# EAGLE design dcdr_3.1 (EAGLE 7.7.0)
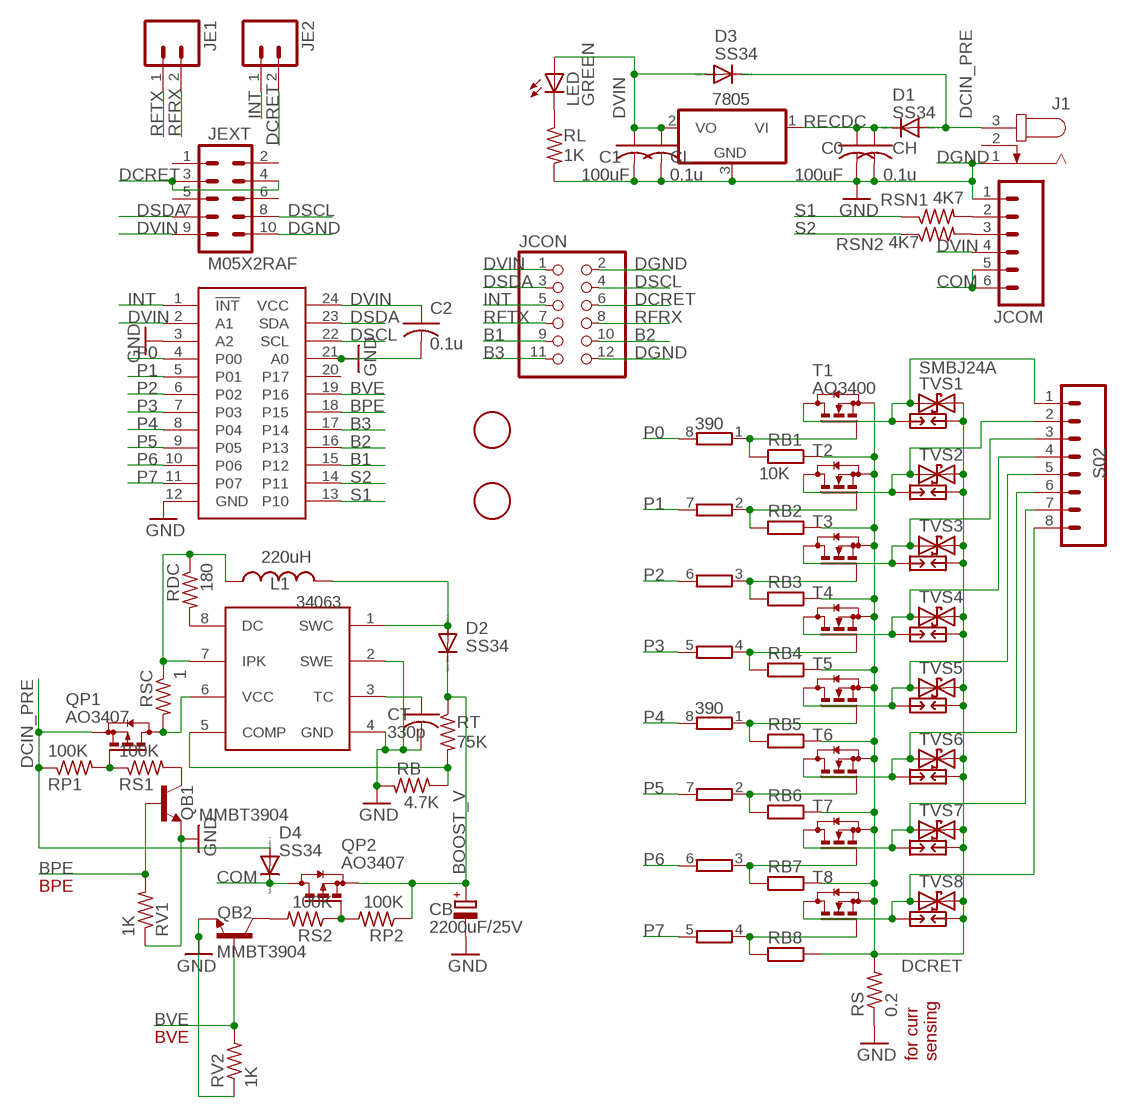
[diagram p0: schematic, sheet 1]

## Parts
7805  7805DT  [TO252]
34063  MC34063  MC33063/MC34063D  [SO08]
C0  100uF  C-USC0805K  [C0805K]
C1  100uF  C-USC0805K  [C0805K]
C2  0.1u  C-USC0603  [C0603]
CB  2200uF/25V  CPOL-EUE7.5-16  [E7,5-16]
CH  0.1u  C-USC0603  [C0603]
CL  0.1u  C-USC0603  [C0603]
CT  330p  C-USC0603K  [C0603K]
D1  SS34  DIODE-SMB  [SMB]
D2  SS34  DIODE-SMB  [SMB]
D3  SS34  DIODE-SMB  [SMB]
D4  SS34  DIODE-SMB  [SMB]
J1  JACK-PLUG0  [SPC4077]
JCOM  M065MM  [SCREWTERMINAL-5MM-6]
JCON  PINHD-2X6  [2X06]
JE1  M02PTH  [1X02]
JE2  M02PTH  [1X02]
JEXT  M05X2RAF  [2X5-RAF]
L1  220uH  INDUCTORCR54  [CR54]
LED  GREEN  LEDCHIPLED_0805  [CHIPLED_0805]
PCA9555  PCA9555  PCF8575TSSOP24  [TSSOP24]
QB1  MMBT3904  TRANSISTOR_NPNSOT23-3  [SOT23-3]
QB2  MMBT3904  TRANSISTOR_NPNSOT23-3  [SOT23-3]
QP1  AO3407  BSS84  [SOT23]
QP2  AO3407  BSS84  [SOT23]
RB  4.7K  R-US_R0603  [R0603]
RB1  10K  R-EU_R0603  [R0603]
RB2  10K  R-EU_R0603  [R0603]
RB3  10K  R-EU_R0603  [R0603]
RB4  10K  R-EU_R0603  [R0603]
RB5  10K  R-EU_R0603  [R0603]
RB6  10K  R-EU_R0603  [R0603]
RB7  10K  R-EU_R0603  [R0603]
RB8  10K  R-EU_R0603  [R0603]
RDC  180  R-US_R0603  [R0603]
RL  1K  R-US_R0603  [R0603]
RN1  390  4R-NEXB38V  [EXB38V]
RN2  390  4R-NEXB38V  [EXB38V]
RP1  100K  R-US_R0603  [R0603]
RP2  100K  R-US_R0603  [R0603]
RS  0.2  R-US_R2512  [R2512]
RS1  100K  R-US_R0603  [R0603]
RS2  100K  R-US_R0603  [R0603]
RSC  1  R-US_R0603  [R0603]
RSN1  4K7  R-US_R0603  [R0603]
RSN2  4K7  R-US_R0603  [R0603]
RT  75K  R-US_R0603  [R0603]
RV1  1K  R-US_R0603  [R0603]
RV2  1K  R-US_R0603  [R0603]
S02  M085MM-8  [SCREWTERMINAL-5MM-8]
SP1  PCB-SGAP  [PCB-SGAP]
SP2  PCB-SGAP  [PCB-SGAP]
SP3  PCB-SGAP  [PCB-SGAP]
SP4  PCB-SGAP  [PCB-SGAP]
SP5  PCB-SGAP  [PCB-SGAP]
SP6  PCB-SGAP  [PCB-SGAP]
SP7  PCB-SGAP  [PCB-SGAP]
SP8  PCB-SGAP  [PCB-SGAP]
T1  AO3400  BSS123  [SOT23]
T2  AO3400  BSS123  [SOT23]
T3  AO3400  BSS123  [SOT23]
T4  AO3400  BSS123  [SOT23]
T5  AO3400  BSS123  [SOT23]
T6  AO3400  BSS123  [SOT23]
T7  AO3400  BSS123  [SOT23]
T8  AO3400  BSS123  [SOT23]
TVS1  SMBJ24A  TVSSMB  [SMB]
TVS2  SMBJ24A  TVSSMB  [SMB]
TVS3  SMBJ24A  TVSSMB  [SMB]
TVS4  SMBJ24A  TVSSMB  [SMB]
TVS5  SMBJ24A  TVSSMB  [SMB]
TVS6  SMBJ24A  TVSSMB  [SMB]
TVS7  SMBJ24A  TVSSMB  [SMB]
TVS8  SMBJ24A  TVSSMB  [SMB]
U$1  FIDUCIAL  [FIDUCIAL_1MM]
U$2  FIDUCIAL  [FIDUCIAL_1MM]

## Nets
B1: JCON.9 PCA9555.15(P12)
B2: JCON.10 PCA9555.16(P13)
B3: JCON.11 PCA9555.17(P14)
BOOST_V: CB.+ D2.C QP2.2(S) RP2.1 RT.1
BPE: PCA9555.18(P15) QB1.1(B) RV1.2
BVE: PCA9555.19(P16) QB2.1(B) RV2.2
COM [power]: D4.C JCOM.5 JCOM.6 QP2.3(D)
DCIN_PRE: D1.A D3.C D4.A J1.3 QP1.2(S) RP1.1
DCRET: JCON.6 JE2.2 JEXT.3 JEXT.4 RB1.1 RB2.1 RB3.1 RB4.1 RB5.1 RB6.1 RB7.1 RB8.1 RS.2 SP1.1 SP2.1 SP3.1 SP4.1 SP5.1 SP6.1 SP7.1 SP8.1 T1.2(S) T2.2(S) T3.2(S) T4.2(S) T5.2(S) T6.2(S) T7.2(S) T8.2(S) TVS1.C TVS2.C TVS3.C TVS4.C TVS5.C TVS6.C TVS7.C TVS8.C
DGND [power]: 7805.3(GND) 34063.2(SWE) 34063.4(GND) C0.2 C1.2 C2.2 CB.- CH.2 CL.2 CT.2 J1.1 JCOM.1 JCON.2 JCON.12 JEXT.10 PCA9555.3(A2) PCA9555.12(GND) PCA9555.21(A0) QB1.2(E) QB2.2(E) RB.2 RL.2 RS.1 RV1.1 RV2.1 ; supply symbol labelled GND
DSCL: JCON.4 JEXT.8 PCA9555.22(SCL)
DSDA: JCON.3 JEXT.7 PCA9555.23(SDA)
DVIN [power]: 7805.2(VO) C1.1 C2.1 CL.1 D3.A JCOM.4 JCON.1 JEXT.9 LED.A PCA9555.2(A1) PCA9555.24(VCC)
INT: JCON.5 JE2.1 PCA9555.1(!INT)
N$1: 34063.1(SWC) D2.A L1.P$2
N$2: JCOM.2 RSN1.2
N$3: JCOM.3 RSN2.2
N$8: RB1.2 RN1.1 T1.1(G)
N$9: RB2.2 RN1.2 T2.1(G)
N$15: RB3.2 RN1.3 T3.1(G)
N$16: RB4.2 RN1.4 T4.1(G)
N$17: 34063.3(TC) CT.1
N$18: RB5.2 RN2.1 T5.1(G)
N$19: RB6.2 RN2.2 T6.1(G)
N$21: RB7.2 RN2.3 T7.1(G)
N$22: RB8.2 RN2.4 T8.1(G)
N$24: 34063.8(DC) RDC.2
N$26: 34063.7(IPK) L1.P$1 RDC.1 RSC.1
N$27: 34063.6(VCC) QP1.3(D) RSC.2
N$28: LED.C RL.1
N$29: 34063.5(COMP) RB.1 RT.2
N$30: QP1.1(G) RP1.2 RS1.1
N$34: QB2.3(C) RS2.2
N$35: QB1.3(C) RS1.2
N$38: QP2.1(G) RP2.2 RS2.1
N$50 [power]: S02.1 SP1.2 T1.3(D) TVS1.A
N$51 [power]: S02.2 SP2.2 T2.3(D) TVS2.A
N$52 [power]: S02.3 SP3.2 T3.3(D) TVS3.A
N$53 [power]: S02.4 SP4.2 T4.3(D) TVS4.A
N$54 [power]: S02.5 SP5.2 T5.3(D) TVS5.A
N$55 [power]: S02.6 SP6.2 T6.3(D) TVS6.A
N$56 [power]: S02.7 SP7.2 T7.3(D) TVS7.A
N$57 [power]: S02.8 SP8.2 T8.3(D) TVS8.A
P0: PCA9555.4(P00) RN1.8
P1: PCA9555.5(P01) RN1.7
P2: PCA9555.6(P02) RN1.6
P3: PCA9555.7(P03) RN1.5
P4: PCA9555.8(P04) RN2.8
P5: PCA9555.9(P05) RN2.7
P6: PCA9555.10(P06) RN2.6
P7: PCA9555.11(P07) RN2.5
RECDC: 7805.1(VI) C0.1 CH.1 D1.C
RFRX: JCON.8 JE1.2
RFTX: JCON.7 JE1.1
S1: PCA9555.13(P10) RSN1.1
S2: PCA9555.14(P11) RSN2.1
Unconnected: J1.2 JEXT.1 JEXT.2 JEXT.5 JEXT.6 PCA9555.20(P17)

## Notes on the sheet
- BPE
- BVE
- for curr
  sensing

## Library data of the parts
7805 = linear:78*: Positive VOLTAGE REGULATOR Source: http://cache.national.com/ds/LM/LM78L05.pdf http://www.fairchildsemi.com/ds/LM/LM7805.pdf
34063 = adafruit:MC33063/MC34063: MC33063 and MC34063 Basic DC/DC converter with internal power-NPN transistor, 100KHz, 1.5A peak switch current. 3-40 input/output.
C0 C1 C2 CH CL CT = adafruit:C-US: CAPACITOR, American symbol
CB = rcl:CPOL-EU: POLARIZED CAPACITOR, European symbol
D1-D4 = diode:DIODE-: DIODE
J1 = con-jack:JACK-PLUG: DC POWER JACK Power Jack, DC, Right Angle, Through Hole, Rated 5A at 16VDC, PC Terminals Distributor: Farnell (www.Farnell.de) Drawing: 84N1161.pdf / 84N1162.pdf Manufacturer: SPC Technology (www.spctechnology.com) Type: SPC4077 / SPC 4078; OC_FARNELL: unknown; OC_NEWARK: unknown
JCOM = SparkFun:M06: Header 6 Standard 6-pin 0.1" header. Use with straight break away headers (SKU : PRT-00116), right angle break away headers (PRT-00553), swiss pins (PRT-00743), machine pins (PRT-00117), and female headers (PRT-00115). Molex polarized connector foot print use with SKU : PRT-08094 with associated crimp pins and housings. NOTES ON THE VARIANTS LOCK and LOCK_LONGPADS... This footprint was designed to help hold the alignment of a through-hole component (i.e. 6-pin header) while soldering it into place. You may notice that each hole has been shifted either up or down by 0.005 of an inch from it's more standard position (which is a perfectly straight line). This slight alteration caused the pins (the squares in the middle) to touch the edges of the holes. Because they are alternating, it causes a "brace" to hold the component in place. 0.005 has proven to be the perfect amount of "off-center" position when using our standard breakaway headers. Although looks a little odd when you look at the bare footprint, once you have a header in there, the alteration is very hard to notice. Also, if you push a header all the way into place, it is covered up entirely on the bottom side. This idea of altering the position of holes to aid alignment will be further integrated into the Sparkfun Library for other footprints. It can help hold any component with 3 or more connection pins.
JCON = pinhead:PINHD-2X6: PIN HEADER
JE1 JE2 = SparkFunNew:M02: Header 2 Standard 2-pin 0.1" header. Use with straight break away headers (SKU : PRT-00116), right angle break away headers (PRT-00553), swiss pins (PRT-00743), machine pins (PRT-00117), and female headers (PRT-00115). Molex polarized connector foot print use with SKU : PRT-08233 with associated crimp pins and housings.
JEXT = SparkFunNew:M05X2: Header 5x2 Standard 10-pin dual row 0.1" header. Commonly used with AVR-ISP. Use with Spark Fun Electronics SKU: PRT-00778
L1 = SparkFunNew:INDUCTOR: Inductors Basic Inductor/Choke - 0603 and 1206. Footprints are not proven and vary greatly between part numbers.
LED = adafruit:LED: LED OSRAM: - CHIPLED LG R971, LG N971, LY N971, LG Q971, LY Q971, LO R971, LY R971 LH N974, LH R974 LS Q976, LO Q976, LY Q976 LO Q996 - Hyper CHIPLED LW Q18S LB Q993, LB Q99A, LB R99A - SideLED LS A670, LO A670, LY A670, LG A670, LP A670 LB A673, LV A673, LT A673, LW A673 LH A674 LY A675 LS A676, LA A676, LO A676, LY A676, LW A676 LS A679, LY A679, LG A679 - Hyper Micro SIDELED® LS Y876, LA Y876, LO Y876, LY Y876 LT Y87S - SmartLED LW L88C, LW L88S LB L89C, LB L89S, LG L890 LS L89K, LO L89K, LY L89K LS L896, LA L896, LO L896, LY L896 - TOPLED LS T670, LO T670, LY T670, LG T670, LP T670 LSG T670, LSP T670, LSY T670, LOP T670, LYG T670 LG T671, LOG T671, LSG T671 LB T673, LV T673, LT T673, LW T673 LH T674 LS T676, LA T676, LO T676, LY T676, LB T676, LH T676, LSB T676, LW T676 LB T67C, LV T67C, LT T67C, LS T67K, LO T67K, LY T67K, LW E67C LS E67B, LA E67B, LO E67B, LY E67B, LB E67C, LV E67C, LT E67C LW T67C LS T679, LY T679, LG T679 LS T770, LO T770, LY T770, LG T770, LP T770 LB T773, LV T773, LT T773, LW T773 LH T774 LS E675, LA E675, LY E675, LS T675 LS T776, LA T776, LO T776, LY T776, LB T776 LHGB T686 LT T68C, LB T68C - Hyper Mini TOPLED® LB M676 - Mini TOPLED Santana® LG M470 LS M47K, LO M47K, LY M47K Source: http://www.osram.convergy.de/
PCA9555 = SparkFunNew:PCF8575
QB1 QB2 = SparkFunNew:TRANSISTOR_NPN: Transistor NPN BJT configuration in SOT23 package. MMBT2222 is the common NPN we use. Double check BCE configuration again layout.
QP1 QP2 = transistor-small-signal:BSS84: P-CHANNEL MOS FET
RB RDC RP1 RP2 RS1 RS2 RSC RT RV1 RV2 = adafruitGood:R-US_: RESISTOR, American symbol
RB1-RB8 = rcl:R-EU_: RESISTOR, European symbol
RL RSN1 RSN2 = adafruit2013:R-US_: RESISTOR, American symbol
RN1 RN2 = resistor-dil:4R-N: Array Chip Resistor Source: RS Component / Phycomp; OC_FARNELL: unknown; OC_NEWARK: unknown
RS = adafruit:R-US_: RESISTOR, American symbol
S02 = SparkFun:M08: Header 8 Standard 8-pin 0.1" header. Use with straight break away headers (SKU : PRT-00116), right angle break away headers (PRT-00553), swiss pins (PRT-00743), machine pins (PRT-00117), and female headers (PRT-00115).
SP1-SP8 = varistor:PCB-SGAP
T1-T8 = transistor-small-signal:BSS123: N-CHANNEL MOS FET
TVS1-TVS8 = SparkFunNew:TVS
U$1 U$2 = adafruitGood:FIDUCIAL: For use by pick and place machines to calibrate the vision/machine, 1mm By microbuilder.eu

## Net classes
0 default: width 0.178 mm, clearance 0.178 mm
1 power: width 0.178 mm, clearance 0.178 mm
2 relaypower: width 0.178 mm, clearance 0.178 mm
3 signal: width 0.178 mm, clearance 0.178 mm
4 adc: width 0.406 mm, clearance 0.178 mm

## Board
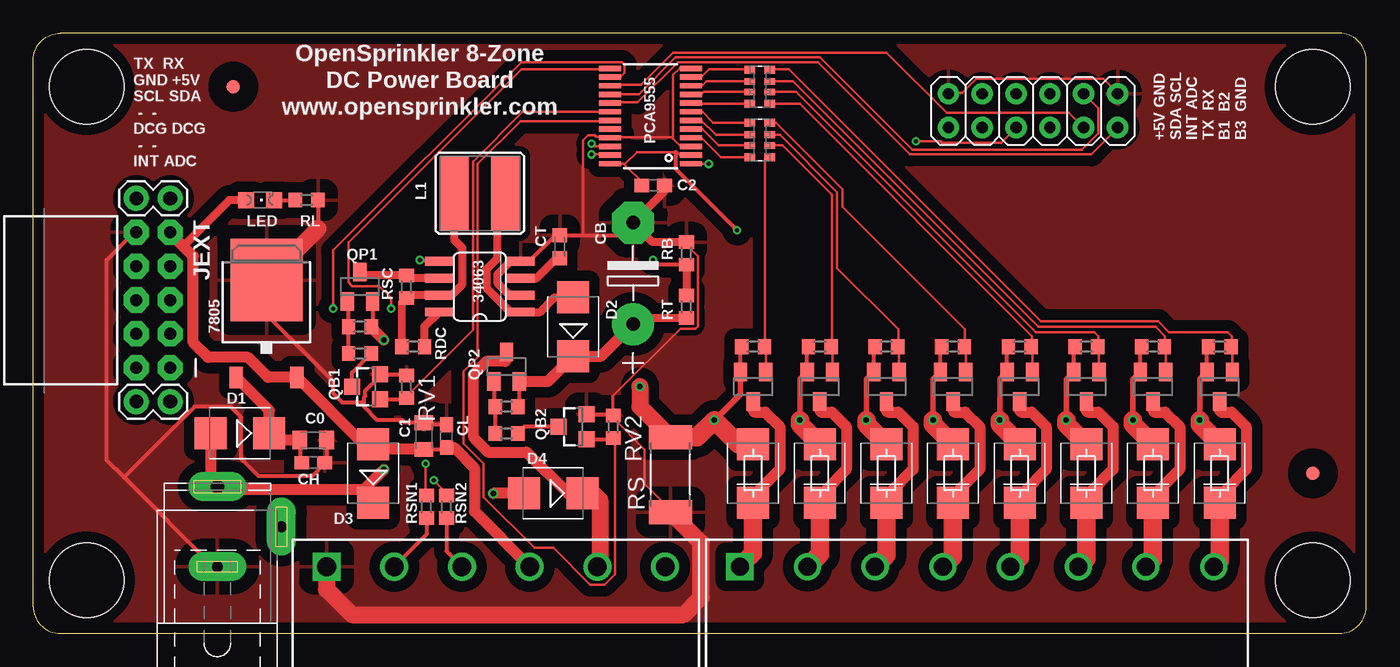
[diagram p1: board, top side]
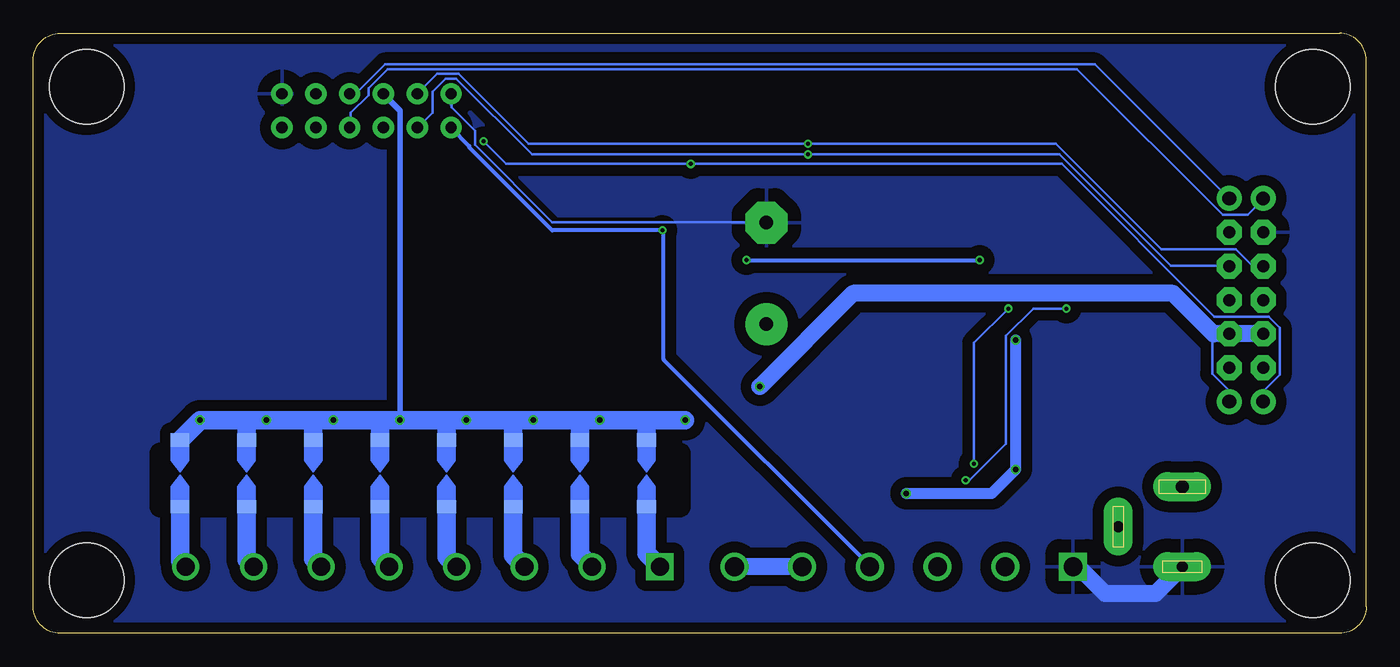
[diagram p2: board, bottom side, seen from below]

Size 100 x 45 mm. Coordinates in mm from the lower left corner, seen from the top.
Outline: 2,0 98,0 arc90 100,2 100,43 arc90 98,45 2,45 arc90 0,43 0,2 arc90 2,0
Copper layers (1*16): Top 0.035mm / dielectric 1.5mm / Bottom 0.035mm
Design rules "Fusion_eagle_rule_v1.1 *": minimum track width 6mil, minimum drill 12mil, track to track 6mil, track to pad 6mil, pad to pad 6mil, via to via 6mil, smd to smd 0mil, copper to edge 10mil, drill to drill 10mil, minimum pad ring 10mil, minimum via ring 6mil, stop-mask expansion 2mil, vias tented up to drill 100mil, thermal gap 40mil
Holes 5.6 mm at 4,4 96,4 4,41 96,41
bRestrict: area 51.5,9.5 to 90.5,13.5

### Footprints (pad centres in the part's own frame; a part is rotated, then mirrored left to right if it is on the bottom)
TO252 = smd 1 x 1.6: 1 -2.28,-4.8; 2 2.28,-4.8 | smd 5.4 x 6.2: 3 0,2.5
SO08 = smd 0.66 x 2.032: 1 -1.905,-3.073; 2 -0.635,-3.073; 3 0.635,-3.073; 4 1.905,-3.073; 5 1.905,3.073; 6 0.635,3.073; 7 -0.635,3.073; 8 -1.905,3.073
C0805K = smd 1.1 x 1.4: 1 -1,0; 2 1,0
C0603 = smd 1.1 x 1: 1 -0.85,0; 2 0.85,0
E7,5-16 = drill 1.016 pad 3.15: + -3.81,0 | drill 1.016 pad 3.15 octagon: - 3.81,0
C0603K = smd 1.05 x 1.08: 1 -0.875,0; 2 0.875,0
SMB = smd 2.4 x 2.4: A 2.2,0; C -2.2,0
SPC4077 = drill 0.8 pad 2.184 long: 1 -3,0; 2 0,-4.8 | drill 1 pad 2.184 long: 3 3,0
SCREWTERMINAL-5MM-6 = drill 1.4 pad 2.032 square: 1 0,0 | drill 1.4 pad 2.032: 2 5.08,0; 3 10.16,0; 4 15.24,0; 5 20.32,0; 6 25.4,0
2X06 = drill 0.85 pad 1.6: 1 -6.35,-1.27; 2 -6.35,1.27; 3 -3.81,-1.27; 4 -3.81,1.27; 5 -1.27,-1.27; 6 -1.27,1.27; 7 1.27,-1.27; 8 1.27,1.27; 9 3.81,-1.27; 10 3.81,1.27; 11 6.35,-1.27; 12 6.35,1.27
1X02 = drill 1.016 pad 1.88: 1 0,0; 2 2.54,0
2X5-RAF = drill 0.9 pad 1.88 octagon: 1 -1.27,5.08; 2 1.27,5.08; 3 -1.27,2.54; 4 1.27,2.54; 5 -1.27,0; 6 1.27,0; 7 -1.27,-2.54; 8 1.27,-2.54; 9 -1.27,-5.08; 10 1.27,-5.08
CR54 = smd 5.5 x 2.15: P$1 0,1.92; P$2 0,-1.92
CHIPLED_0805 = smd 1.2 x 1.2: A 0,-1.05; C 0,1.05
TSSOP24 = smd 0.4 x 1.65: 1 -3.575,-3.05; 2 -2.925,-3.05; 3 -2.275,-3.05; 4 -1.625,-3.05; 5 -0.975,-3.05; 6 -0.325,-3.05; 7 0.325,-3.05; 8 0.975,-3.05; 9 1.625,-3.05; 10 2.275,-3.05; 11 2.925,-3.05; 12 3.575,-3.05; 13 3.575,3.05; 14 2.925,3.05; 15 2.275,3.05; 16 1.625,3.05; 17 0.975,3.05; 18 0.325,3.05; 19 -0.325,3.05; 20 -0.975,3.05; 21 -1.625,3.05; 22 -2.275,3.05; 23 -2.925,3.05; 24 -3.575,3.05
SOT23-3 = smd 1.2 x 1.2: 1 -0.95,-1; 2 0.95,-1; 3 0,1.1
SOT23 = smd 1 x 1.4: 1 -0.95,-1.1; 2 0.95,-1.1; 3 0,1.1
R0603 = smd 1 x 1.1: 1 -0.85,0; 2 0.85,0
EXB38V = smd 0.6 x 0.8: 1 -1.275,-0.75; 4 1.275,-0.75; 5 1.275,0.75; 8 -1.275,0.75 | smd 0.5 x 0.8: 2 -0.4,-0.75; 3 0.4,-0.75; 6 0.4,0.75; 7 -0.4,0.75
R2512 = smd 1.8 x 3.2: 1 -2.8,0; 2 2.8,0
SCREWTERMINAL-5MM-8 = drill 1.35 pad 2.032 square: 1 0,0 | drill 1.35 pad 2.032: 2 5.08,0; 3 10.16,0; 4 15.24,0; 5 20.32,0; 6 25.4,0; 7 30.48,0; 8 35.56,0
PCB-SGAP = smd 1 x 1.4 bottom: 1 -2.5,0; 2 2.5,0
FIDUCIAL_1MM = smd 1 x 1: 1 0,0

### Placement (x,y rotation side)
7805  17.5,24 0 top
34063  33.5,26 90 top
C0  21,14.5 0 top
C1  29.3,14.8 90 top
C2  46.5,33.6 0 top
CB  45,27 90 top
CH  21,12.8 0 top
CL  31,14.8 90 top
CT  39.5,29 90 top
D1  15.5,15 180 top
D2  40.5,23 90 top
D3  25.5,12 90 top
D4  39,10.5 180 top
J1  13.8,8 90 top
JCOM  22,5 0 top
JCON  75,39.2 0 top
JE1  7.73,32.62 0 top
JE2  7.73,17.38 0 top
JEXT  9,25 180 top
L1  33.5,33 90 top
LED  17,32.5 270 top
PCA9555  46.3,38.8 90 top
QB1  25,18.5 90 top
QB2  40.5,15.5 90 top
QP1  24.5,26 0 top
QP2  35.5,20 0 top
RB  49,28.5 90 top
RB1  54,21.5 0 top
RB2  59,21.5 0 top
RB3  64,21.5 0 top
RB4  69,21.5 0 top
RB5  74,21.5 0 top
RB6  79,21.5 0 top
RB7  84,21.5 0 top
RB8  89,21.5 0 top
RDC  28.5,21.5 0 top
RL  20.5,32.5 0 top
RN1  54.5,37 90 top
RN2  54.5,41 90 top
RP1  24.5,23 180 top
RP2  35.5,17 180 top
RS  47.8,11.9 90 top
RS1  24.5,21 0 top
RS2  35.5,15 0 top
RSC  28,26 90 top
RSN1  29.5,9.5 270 top
RSN2  31,9.5 270 top
RT  49,24.5 90 top
RV1  28,18.5 270 top
RV2  43.5,15.5 270 top
S02  53,5 0 top
SP1  54,12 270 top
SP2  59,12 270 top
SP3  64,12 270 top
SP4  69,12 270 top
SP5  74,12 270 top
SP6  79,12 270 top
SP7  84,12 270 top
SP8  89,12 270 top
T1  54,18.5 180 top
T2  59,18.5 180 top
T3  64,18.5 180 top
T4  69,18.5 180 top
T5  74,18.5 180 top
T6  79,18.5 180 top
T7  84,18.5 180 top
T8  89,18.5 180 top
TVS1  54,12 270 top
TVS2  59,12 270 top
TVS3  64,12 270 top
TVS4  69,12 270 top
TVS5  74,12 270 top
TVS6  79,12 270 top
TVS7  84,12 270 top
TVS8  89,12 270 top
U$1  15,41 0 top
U$2  96,12 0 top

### Tracks (layer width: path | path; a pad name or v marks a point on that pad's centre or on a via)
B1
  Top 0.178: PCA9555.15 43.29,41.16 45.61,41.16 48.01,43.56 64.01,43.56 68.54,39.03 77.7,39.03 78.77,37.96 JCON.9
B2
  Top 0.178: PCA9555.16 43.29,40.45 45.43,40.45 48.18,43.2 59.03,43.2 65.96,36.27 78.68,36.27 79.92,37.52 79.92,39.38 78.85,40.45 JCON.10
B3
  Top 0.178: PCA9555.17 43.29,39.83 45.34,39.83 48.36,42.85 58.85,42.85 65.79,35.92 79.39,35.92 81.34,37.87 JCON.11
BOOST_V
  Top 0.305: QP2.2 36.45,17.1 RP2.1
  Top 0.61: RT.1 45.46,23.65 CB.+
  Top 0.813: CB.+ 42.61,20.8 D2.C 38.6,18.9 QP2.2
BPE
  Top 0.178: PCA9555.18 43.2,39.12 36.72,39.12 32.98,35.38 32.98,22.76 28,17.78 RV1.2
  Top 0.305: QB1.1 27.9,17.55 RV1.2
BVE
  Top 0.178: PCA9555.19 43.2,38.41 36.54,38.41 33.34,35.2 33.34,20.71 32.27,19.65 32.27,14.22 33.78,12.71 33.78,10.22 37.6,6.4 39.03,6.4 41.78,3.65 42.85,3.65 43.65,4.45 43.65,14.13 43.38,14.4 RV2.2
  Top 0.305: QB2.1 43.4,14.55 RV2.2
COM
  Top 0.813: QP2.3 35.5,20.5 35.4,20.4 34,20.4 33,19.4 33,14.8 33.2,14.5 34.1,13.6 37,13.6 40.1,10.5 D4.C
  Top 1.27: D4.C 42,10.5 42.5,10 42.5,5 JCOM.5
  Bottom 1.27: JCOM.5 JCOM.6
DCIN_PRE  (via drill 0.41)
  Top 0.305: QP1.2 25.45,23.1 RP1.1
  Top 0.813: v26.3,22 25.4,22.9 RP1.1 | v26.3,12.3 24.9,10.9 D3.C 24.5,10.8 14.4,10.8 J1.3 13.3,11.5 D1.A | D4.A v34.5,10.5
  Bottom 0.813: v26.3,22 v26.3,12.3 28.1,10.5 v34.5,10.5
DCRET  (via drill 0.41)
  Top 0.305: T1.2 53.05,21.4 RB1.1 | T2.2 58.05,21.4 RB2.1 | T3.2 63.05,21.4 RB3.1 | T4.2 68.05,21.4 RB4.1 | T5.2 73.05,21.4 RB5.1 | T6.2 78.05,21.4 RB6.1 | T7.2 83.05,21.4 RB7.1 | T8.2 88.05,21.4 RB8.1
  Top 0.406: T1.2 53.05,17.95 v51.1,16 | v57.5,16 57.5,19.05 T2.2 | v62.5,16 62.5,19.05 T3.2 | v67.5,16 67.5,19.05 T4.2 | v77.5,16 77.5,19.05 T6.2 | v82.5,16 82.5,19.05 T7.2 | v87.5,16 87.5,19.05 T8.2 | v72.5,16 72.5,19.05 T5.2
  Top 1.27: v45.5,18.5 45.5,17 RS.2
  Top 1.4: RS.2 49.8,14.7 v51.1,16 52.9,14.2 TVS1.C | v57.5,16 57.5,15.7 TVS2.C | v62.5,16 62.5,15.7 TVS3.C | v67.5,16 67.5,15.7 TVS4.C | v72.5,16 72.5,15.7 TVS5.C | v82.5,16 82.5,15.7 TVS7.C | v87.5,16 87.5,15.7 TVS8.C | v77.5,16 77.5,15.7 TVS6.C
  Bottom 0.178: JE2.2 10.31,17.42 10.31,18.22 11.56,19.47 11.56,21.87 11.46,22.46
  Bottom 0.406: v72.5,16 72.5,39.2 73.7,40.4 JCON.6
  Bottom 1.27: JEXT.4 JEXT.3 11.46,22.46 14.5,25.5 38.5,25.5 v45.5,18.5
  Bottom 1.4: v51.1,16 54,16 | 54,16 v57.5,16 59,16 | 59,16 v62.5,16 64,16 | 64,16 v67.5,16 69,16 | 69,16 v72.5,16 74,16 | 74,16 v77.5,16 79,16 | 79,16 v82.5,16 84,16 | 84,16 v87.5,16 SP8.1 | SP1.1 54,16 | SP2.1 59,16 | SP3.1 64,16 | SP4.1 69,16 | SP5.1 74,16 | SP7.1 84,16 | SP6.1 79,16
DGND
  Top 0.178: JCON.2 68.72,40.54 69.7,40.54 70.76,41.6 80.28,41.6 81.34,40.54 JCON.12 | 41.25,29.88 41.25,36.98 41.6,37.34 42.14,37.34 42.23,37.25 43.2,37.25 PCA9555.21 | 21.25,32.54 RL.2 | RS.1 47.47,9.6 45.87,11.2 45.87,13.78 43.56,16.09 43.56,16.27 RV2.1 43.47,16.54 43.47,17.78 48.54,22.85 49.7,22.85 49.87,23.02 49.87,28.27 49.07,29.07 RB.2
  Top 0.203: 48,37.2 48,41.9 48.5,42.4 49.3,42.4 PCA9555.12 | 48,37.2 48,37.1 48.6,36.5 49.3,36.5 PCA9555.3 | 48,37.2 43.3,37.2 PCA9555.21
  Top 0.305: 34063.4 36.8,27.9 37.2,27.9 39.2,29.9 39.5,29.9 CT.2 41.25,29.88 44.06,29.88 CB.- | RL.2 21.35,30.35 | CL.2 29.45,15.65 C1.2 27.9,15.8 27.7,16 25.8,16 24.8,17 24.8,17.3 | RV1.1 27.9,19.45 QB1.2 26,19.3 24.9,18.2 24.9,17.8 24.8,17.7 24.8,17.3 | QB2.2 43.4,16.45 RV2.1 | 24.8,17.3 23.2,17.3 22.5,18 22.5,18.9 17.5,23.9 7805.3 | C0.2 22,12.95 CH.2 21.85,12.75 20.9,11.8 16.9,11.8 15.6,13.1 15.6,16.2 14.8,17 12.1,17 6.8,11.7 | 6.8,11.7 13.5,5 J1.1 | 6.8,11.7 5.5,13 5.5,28 7.5,30 JEXT.10
  Top 0.61: 34063.2 36.5,25.4 35.7,25.4 34.8,26.3 34.8,26.9 35.8,27.9 36.5,27.9 34063.4 | RB.2 46.46,29.35 CB.- 47.35,33.16 C2.2
  Top 1.27: JCOM.1 22,3.3 23.9,1.4 48.8,1.4 50.1,2.7 50.1,6.8 RS.1 | 21.35,30.35 7805.3
  Bottom 0.178: JCON.2 68.63,40.45 68.63,39.47 66.85,37.69 66.85,36.63 61.07,30.85 45.07,30.85 CB.-
  Bottom 1.27: JCOM.1 21.6,5 19.6,3 15.8,3 J1.1
  pour Top (isolate 0.813): 0,45 100,45 100,0 0,0
  pour Bottom (isolate 0.813): 0,45 100,45 100,0 0,0
DSCL  (via drill 0.3)
  Top 0.178: v41.87,36.72 42.05,36.54 43.2,36.54 PCA9555.22
  Bottom 0.178: JCON.4 71.12,40.54 69.7,41.96 68.1,41.96 62.85,36.72 v41.87,36.72 23.29,36.72 15.38,28.8 9.78,28.8 8.53,27.56 7.73,27.56 JEXT.8
DSDA  (via drill 0.3)
  Top 0.178: v41.87,35.92 43.2,35.92 PCA9555.23
  Bottom 0.178: JCON.3 71.12,37.96 70.05,39.03 70.05,40.63 69.08,41.6 68.28,41.6 62.59,35.92 v41.87,35.92 23.02,35.92 14.67,27.56 10.31,27.56 JEXT.7
DVIN  (via drill 0.3)
  Top 0.203: 44.4,35.2 45.3,36.1 48.18,36.1 48.3,36.1 48.5,35.9 49.3,35.9 PCA9555.2 | 44.4,35.2 43.3,35.2 PCA9555.24 | C2.1 45.8,33.6 45.8,33.7 44.4,35.1 44.4,35.2
  Top 0.305: C1.1 30.85,13.8 CL.1 | v52.81,30.23 48.18,34.85 48.18,36.1
  Top 0.61: 11.25,29.05 14.7,32.5 LED.A
  Top 0.813: JEXT.9 10.3,30 11.25,29.05 12,28.3 12,21.8 13.1,20.7 16.1,20.7 17.6,19.2 7805.2 24.78,14.2 D3.A 25.9,13.8 C1.1 | CL.1 31.55,13.95 33.1,12.4 33.1,9.14 JCOM.4
  Bottom 0.305: JCON.1 68.63,37.87 67.3,36.54 67.3,36.45 61.07,30.23 v52.81,30.23 52.72,30.14 52.72,20.54 37.25,5.07 JCOM.4
INT  (via drill 0.3)
  Top 0.178: v50.67,35.2 49.43,35.2 PCA9555.1 | v66.23,36.89 68.1,36.89 68.19,36.8 72.63,36.8 73.7,37.87 JCON.5
  Bottom 0.178: v66.23,36.89 64.54,35.2 v50.67,35.2 22.85,35.2 11.38,23.74 7.29,23.74 6.49,22.94 6.49,19.38 7.64,18.22 7.64,17.42 JE2.1
N$1
  Top 0.61: L1.P$2 35.4,33 35.4,31.6 34.8,31 34.8,28.1 34,27.3 34,25.9 35.8,24.1 36.5,24.1 34063.1 36.8,24.1 38,24.1 39.1,25.2 D2.A
N$2
  Top 0.305: RSN1.2 29.5,7.42 JCOM.2
N$3
  Top 0.305: RSN2.2 31,6.16 JCOM.3
N$8
  Top 0.203: RN1.1 55.2,35.7 55,35.7 54.9,35.6 54.9,21.5 RB1.2 54.95,21.4 T1.1
N$9
  Top 0.203: RN1.2 56.2,36.6 59.9,32.9 59.9,21.5 RB2.2 59.95,21.4 T2.1
N$15
  Top 0.203: RN1.3 56,37.4 60.3,33.1 60.3,27.4 64.9,22.8 64.9,21.5 RB3.2 64.95,21.4 T3.1
N$16
  Top 0.203: RN1.4 55.3,38.3 55.7,38.3 60.7,33.3 60.7,32 69.9,22.8 69.9,21.5 RB4.2 69.95,21.4 T4.1
N$17
  Top 0.61: CT.1 39.5,28.1 39.2,28.1 37.7,26.6 36.6,26.6 34063.3
N$18
  Top 0.203: RN2.1 55.3,39.7 57.5,39.7 74.9,22.3 74.9,21.5 RB5.2 74.95,21.4 T5.1
N$19
  Top 0.203: RN2.2 57.2,40.6 75.2,22.6 79.6,22.6 79.9,22.3 79.9,21.5 RB6.2 79.95,21.4 T6.1
N$21
  Top 0.203: RN2.3 57,41.4 75.4,23 84.2,23 84.9,22.3 84.9,21.5 RB7.2 84.95,21.4 T7.1
N$22
  Top 0.203: RN2.4 55.3,42.3 56.7,42.3 75.6,23.4 84.4,23.4 85.2,22.6 89.6,22.6 89.9,22.3 89.9,21.5 RB8.2 89.95,21.4 T8.1
N$24
  Top 0.61: RDC.2 29.35,23.02 34063.8
N$26
  Top 0.61: L1.P$1 31.6,33 31.6,29.5 32.2,28.9 32.2,26.2 31.4,25.4 30.7,25.4 34063.7 28.21,25.36 RSC.1 27.65,24.8 RDC.1
N$27
  Top 0.61: QP1.3 24.75,26.85 RSC.2 28.21,26.64 34063.6
N$28
  Top 0.305: LED.C RL.1
N$29  (via drill 0.3)
  Top 0.305: RB.1 46.85,27.65 v46.5,28 | v29,28 30.33,28 34063.5
  Top 0.61: RB.1 RT.2
  Bottom 0.305: v46.5,28 v29,28
N$30
  Top 0.305: QP1.1 23.65,24.8 RP1.2 RS1.1
N$34
  Top 0.305: QB2.3 36.85,15.5 RS2.2
N$35
  Top 0.305: QB1.3 23.9,19.55 RS1.2
N$38
  Top 0.305: QP2.1 34.55,17.1 RP2.2 RS2.1
N$50
  Top 0.813: T1.3 54,16.7 54.1,16.6 54.9,16.6 56,15.5 56,12.3 54.3,10.6 54.3,10.4 TVS1.A
  Top 1.4: TVS1.A 54,6 S02.1
  Bottom 1.4: SP1.2 54,6 S02.1
N$51
  Top 0.813: T2.3 59,16.7 59.1,16.6 59.9,16.6 61,15.5 61,12.3 59.3,10.6 59.3,10.4 TVS2.A
  Top 1.4: TVS2.A 59,5.92 S02.2
  Bottom 1.4: SP2.2 59,5.92 S02.2
N$52
  Top 0.813: T3.3 64,16.7 64.1,16.6 64.9,16.6 66,15.5 66,12.3 64.3,10.6 64.3,10.4 TVS3.A
  Top 1.4: TVS3.A 64,5.84 S02.3
  Bottom 1.4: SP3.2 64,5.84 S02.3
N$53
  Top 0.813: T4.3 69,16.7 69.1,16.6 69.9,16.6 71,15.5 71,12.3 69.3,10.6 69.3,10.4 TVS4.A
  Top 1.4: TVS4.A 69,5.76 S02.4
  Bottom 1.4: SP4.2 69,5.76 S02.4
N$54
  Top 0.813: T5.3 74,16.7 74.1,16.6 74.9,16.6 76,15.5 76,12.3 74.3,10.6 74.3,10.4 TVS5.A
  Top 1.4: TVS5.A 74,5.68 S02.5
  Bottom 1.4: SP5.2 74,5.68 S02.5
N$55
  Top 0.813: T6.3 79,16.7 79.1,16.6 79.9,16.6 81,15.5 81,12.3 79.3,10.6 79.3,10.4 TVS6.A
  Top 1.4: TVS6.A 79,5.6 S02.6
  Bottom 1.4: SP6.2 79,5.6 S02.6
N$56
  Top 0.813: T7.3 84,16.7 84.1,16.6 84.9,16.6 86,15.5 86,12.3 84.3,10.6 84.3,10.4 TVS7.A
  Top 1.4: TVS7.A 84,5.52 S02.7
  Bottom 1.4: SP7.2 84,5.52 S02.7
N$57
  Top 0.813: T8.3 89,16.7 89.1,16.6 89.9,16.6 91,15.5 91,12.3 89.3,10.6 89.3,10.4 TVS8.A
  Top 1.4: TVS8.A 89,5.44 S02.8
  Bottom 1.4: SP8.2 89,5.44 S02.8
P0
  Top 0.203: RN1.8 53.7,35.7 51.6,35.7 50.1,37.2 49.4,37.2 PCA9555.4
P1
  Top 0.203: RN1.7 51.4,36.6 50.2,37.8 49.4,37.8 PCA9555.5
P2
  Top 0.203: RN1.6 51.2,37.4 50.1,38.5 49.4,38.5 PCA9555.6
P3
  Top 0.203: RN1.5 53.7,38.3 51,38.3 50.2,39.1 49.4,39.1 PCA9555.7
P4
  Top 0.203: RN2.8 53.7,39.7 50,39.7 49.9,39.8 49.4,39.8 PCA9555.8
P5
  Top 0.203: RN2.7 50.3,40.6 50.1,40.4 49.4,40.4 PCA9555.9
P6
  Top 0.203: RN2.6 50.5,41.4 50.2,41.1 49.4,41.1 PCA9555.10
P7
  Top 0.203: RN2.5 53.7,42.3 50.7,42.3 50.1,41.7 49.4,41.7 PCA9555.11
RECDC
  Top 0.305: C0.1 20,12.95 CH.1
  Top 0.813: 7805.1 17.7,16.72 D1.C 18.2,14.5 C0.1
RFRX
  Bottom 0.178: JCON.8 76.19,40.54 75.74,40.54 73.61,42.67 20.36,42.67 10.31,32.63 JE1.2
RFTX
  Bottom 0.178: JCON.7 76.19,37.96 76.19,39.03 74.85,40.36 74.85,40.89 73.43,42.32 21.69,42.32 10.76,31.38 8.89,31.38 7.73,32.54 JE1.1
S1  (via drill 0.3)
  Top 0.178: v29.43,12.71 29.43,10.4 RSN1.1 | v26.85,24.36 26.85,25.16 25.96,26.05 23.91,26.05 23.65,26.31 23.65,29.34 36.63,42.32 43.2,42.32 PCA9555.13
  Bottom 0.178: v29.43,12.71 29.43,21.78 v26.85,24.36
S2  (via drill 0.3)
  Top 0.178: v30.05,11.47 30.94,10.58 30.94,10.4 RSN2.1 | v22.49,24.36 22.49,28.71 36.63,42.85 44.18,42.85 44.36,42.67 44.36,42.05 44.09,41.78 43.29,41.78 PCA9555.14
  Bottom 0.178: v30.05,11.47 29.78,11.47 27.03,14.22 27.03,22.31 24.98,24.36 v22.49,24.36

### Text on the board
tNames: OpenSprinkler 8-Zone | DC Power Board | www.opensprinkler.com | +5V GND / SDA SCL / INT ADC / TX RX / B1 B2 / B3 GND | TX RX / GND +5V / SCL SDA / - - / DCG DCG / - - / INT ADC